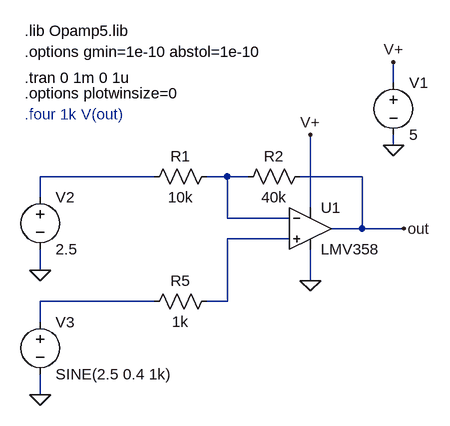
[diagram p0: schematic LMV358_test.asc]
LMV358_test.asc, the LTspice schematic file:
Version 4
SHEET 1 880 680
WIRE 352 -32 352 -64
WIRE 352 64 352 48
WIRE -16 112 -192 112
WIRE 96 112 64 112
WIRE 128 112 96 112
WIRE 304 112 208 112
WIRE -192 144 -192 112
WIRE 224 160 224 48
WIRE 96 176 96 112
WIRE 192 176 96 176
WIRE 304 192 304 112
WIRE 304 192 256 192
WIRE 368 192 304 192
WIRE 192 208 96 208
WIRE -192 256 -192 224
WIRE 224 272 224 224
WIRE -16 304 -192 304
WIRE 96 304 96 208
WIRE 96 304 64 304
WIRE -192 336 -192 304
WIRE -192 448 -192 416
FLAG 224 272 0
FLAG 224 48 V+
FLAG 352 64 0
FLAG 352 -64 V+
FLAG -192 256 0
FLAG -192 448 0
FLAG 368 192 out
SYMBOL Opamps\\opamp2 224 128 R0
SYMATTR InstName U1
SYMATTR Value LMV358
SYMBOL voltage 352 -48 R0
SYMATTR InstName V1
SYMATTR Value 5
SYMBOL res -32 128 R270
WINDOW 0 32 56 VTop 0
WINDOW 3 0 56 VBottom 0
SYMATTR InstName R1
SYMATTR Value 10k
SYMBOL res 112 128 R270
WINDOW 0 32 56 VTop 0
WINDOW 3 0 56 VBottom 0
SYMATTR InstName R2
SYMATTR Value 40k
SYMBOL voltage -192 128 R0
SYMATTR InstName V2
SYMATTR Value 2.5
SYMBOL voltage -192 320 R0
WINDOW 123 0 0 Left 0
WINDOW 39 0 0 Left 0
SYMATTR InstName V3
SYMATTR Value SINE(2.5 0.4 1k)
SYMBOL res -32 320 R270
WINDOW 0 32 56 VTop 0
WINDOW 3 0 56 VBottom 0
SYMATTR InstName R5
SYMATTR Value 1k
TEXT -216 -112 Left 0 !.lib Opamp5.lib
TEXT -216 -40 Left 0 !.tran 0 1m 0 1u
TEXT -216 -80 Left 0 !.options gmin=1e-10 abstol=1e-10
TEXT -216 -16 Left 0 !.options plotwinsize=0
TEXT -216 16 Left 0 ;.four 1k V(out)

The netlist it stands for:
* LMV358_test.asc
XU1 N003 N002 V+ 0 out LMV358  ; pins In+ In- V+ V- OUT
V1 V+ 0 5
R1 N001 N002 10k
R2 N002 out 40k
V2 N001 0 2.5
V3 N004 0 SINE(2.5 0.4 1k)
R5 N004 N003 1k
.lib Opamp5.lib
.tran 0 1m 0 1u
.options gmin=1e-10 abstol=1e-10
.options plotwinsize=0
* .four 1k V(out)
.backanno
.end